# Altium schematic sheet ESP32.SchDoc
size A4
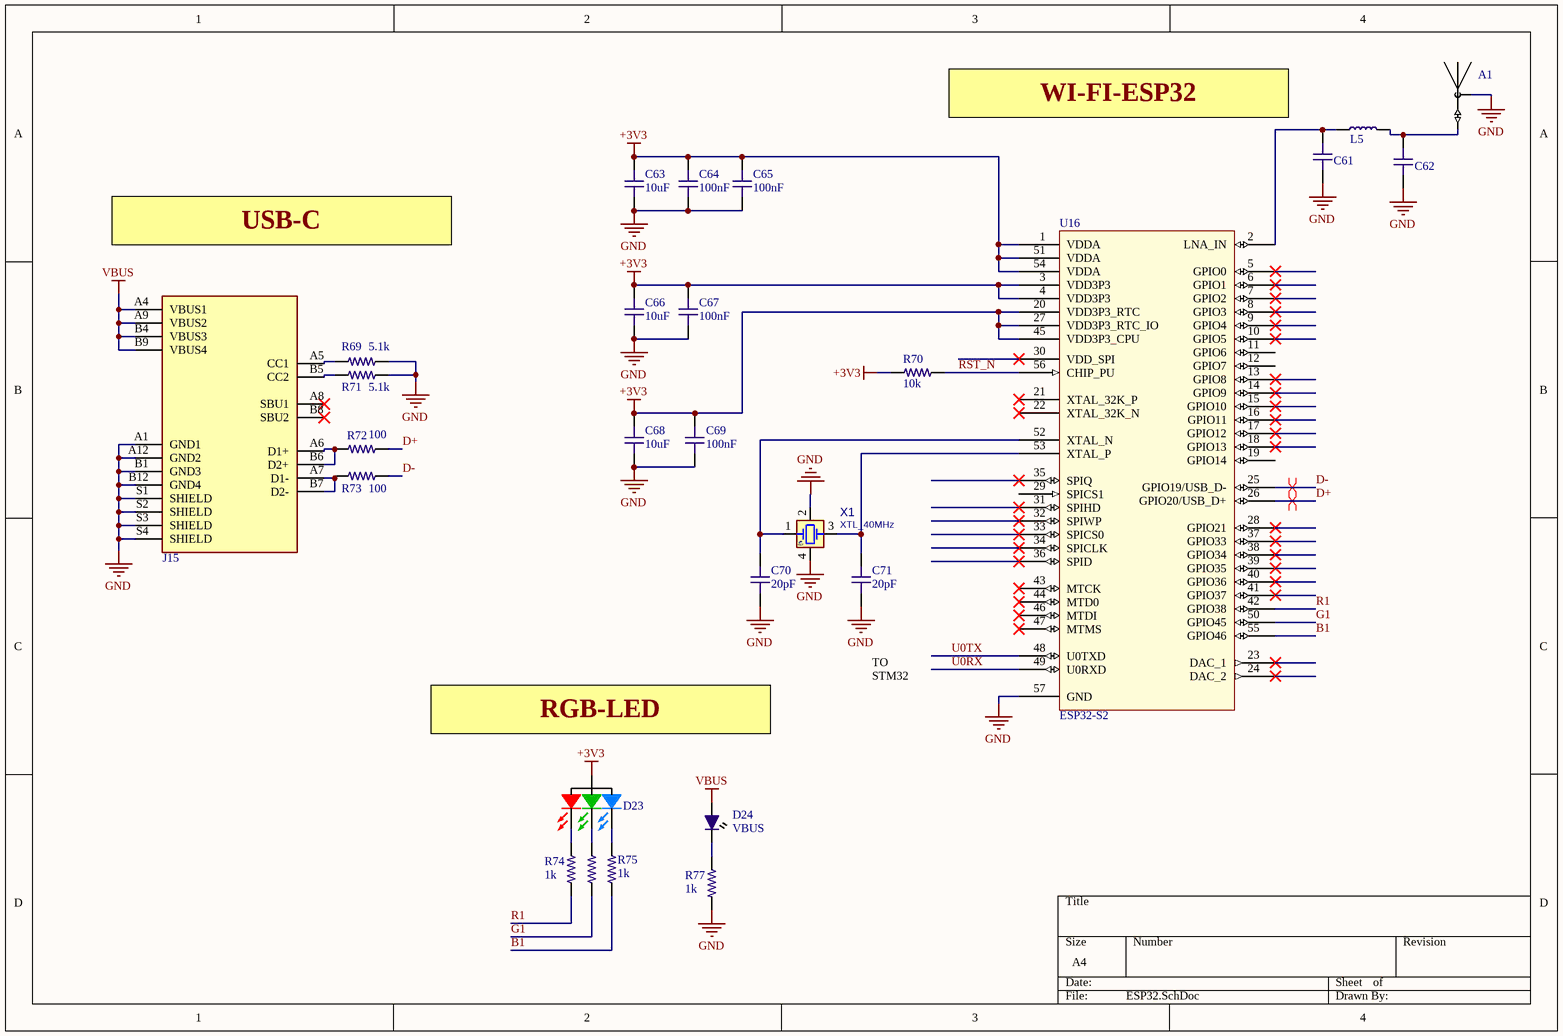
[diagram p0: ESP32.SchDoc]

## Parts
A1  0479480001  [0479480001]  (value not drawn)
C61  0402 Capacitor Template  [C0402-HIGH-DENSITY]  (value not drawn)
C62  0402 Capacitor Template  [C0402-HIGH-DENSITY]  (value not drawn)
C63  value 10uF  [C0402-HIGH-DENSITY]  (hidden comment: C0402 10uF 10V)
C64  value 100nF  [C0402-HIGH-DENSITY]  (hidden comment: C0402 100nF 10V X5R)
C65  value 100nF  [C0402-HIGH-DENSITY]  (hidden comment: C0402 100nF 10V X5R)
C66  value 10uF  [C0402-HIGH-DENSITY]  (hidden comment: C0402 10uF 10V)
C67  value 100nF  [C0402-HIGH-DENSITY]  (hidden comment: C0402 100nF 10V X5R)
C68  value 10uF  [C0402-HIGH-DENSITY]  (hidden comment: C0402 10uF 10V)
C69  value 100nF  [C0402-HIGH-DENSITY]  (hidden comment: C0402 100nF 10V X5R)
C70  value 20pF  [C0402-HIGH-DENSITY]  (hidden comment: C0402 100nF 10V X5R)
C71  value 20pF  [C0402-HIGH-DENSITY]  (hidden comment: C0402 100nF 10V X5R)
D23  RGB  [RGB-LED]  (value not drawn)
D24  VBUS  [LED0603-IPC]
J15  16 Pin Mid Mount USB C  [USB-C - 16 Pin Mid Mount]  (value not drawn)
L5  ! Inductor Template  [L0402-Murata-WW-High-Density]  (value not drawn)
R69  value 5.1k  [R0402-HIGH-DENSITY]  (hidden comment: R0402 5.1K 1%)
R70  value 10k  [R0402-HIGH-DENSITY]  (hidden comment: R0402 10k 1%)
R71  value 5.1k  [R0402-HIGH-DENSITY]  (hidden comment: R0402 5.1K 1%)
R72  value 100  [R0402-HIGH-DENSITY]  (hidden comment: R0402 100R 1%)
R73  value 100  [R0402-HIGH-DENSITY]  (hidden comment: R0402 100R 1%)
R74  value 1k  [R0402-HIGH-DENSITY]  (hidden comment: R0402 1k 1%)
R75  value 1k  [R0402-HIGH-DENSITY]  (hidden comment: R0402 1k 1%)
R76  R0402 1k 1%  [R0402-HIGH-DENSITY]  (value not drawn)
R77  value 1k  [R0402-HIGH-DENSITY]  (hidden comment: R0402 1k 1%)
U16  ESP32-S2  [QFN56]
X1  XTL_40MHz  [XTL_4_2016]

## Nets
+3V3: C63.2 C64.2 C65.2 C66.2 C67.2 C68.2 C69.2 D23.A R70.1 U16.1(VDDA) U16.3(VDD3P3) U16.4(VDD3P3) U16.20(VDD3P3_RTC) U16.27(VDD3P3_RTC_IO) U16.45(VDD3P3_CPU) U16.51(VDDA) U16.54(VDDA)
GND: A1.2 C61.1 C62.1 C63.1 C64.1 C65.1 C66.1 C67.1 C68.1 C69.1 C70.1 C71.1 J15.A1(GND1) J15.A12(GND2) J15.B1(GND3) J15.B12(GND4) J15.S1(SHIELD) J15.S2(SHIELD) J15.S3(SHIELD) J15.S4(SHIELD) R69.2 R71.2 R77.1 U16.57(GND) X1.2(GND1) X1.4(GND2)
VBUS: D24.A J15.A4(VBUS1) J15.A9(VBUS2) J15.B4(VBUS3) J15.B9(VBUS4)
B1: R75.1 U16.55(GPIO46)
D+: R72.2 U16.26(GPIO20/USB_D+)
D-: R73.2 U16.25(GPIO19/USB_D-)
G1: R76.1 U16.50(GPIO45)
R1: R74.1 U16.42(GPIO38)
RST_N: R70.2 U16.56(CHIP_PU)
U0RX: U16.49(U0RXD)
U0TX: U16.48(U0TXD)
NetA1_1: A1.1(FEED) C62.2 L5.2
NetC61_2: C61.2 L5.1 U16.2(LNA_IN)
NetC70_2: C70.2 U16.52(XTAL_N) X1.1(XA)
NetC71_2: C71.2 U16.53(XTAL_P) X1.3(XB)
NetD23_BK: D23.BK R75.2
NetD23_GK: D23.GK R76.2
NetD23_RK: D23.RK R74.2
NetD24_K: D24.K R77.2
NetJ15_A5: J15.A5(CC1) R69.1
NetJ15_A6: J15.A6(D1+) J15.B6(D2+) R72.1
NetJ15_A7: J15.A7(D1-) J15.B7(D2-) R73.1
NetJ15_B5: J15.B5(CC2) R71.1

Not connected (* = marked no-connect by the designer): J15 A8(SBU1)* B8(SBU2)*; U16 5(GPIO0)* 6(GPIO1)* 7(GPIO2)* 8(GPIO3)* 9(GPIO4)* 10(GPIO5)* 11(GPIO6) 12(GPIO7) 13(GPIO8)* 14(GPIO9)* 15(GPIO10)* 16(GPIO11)* 17(GPIO12)* 18(GPIO13)* 19(GPIO14) 21(XTAL_32K_P)* 22(XTAL_32K_N)* 23(DAC_1)* 24(DAC_2)* 28(GPIO21)* 29(SPICS1) 30(VDD_SPI)* 31(SPIHD)* 32(SPIWP)* 33(SPICS0)* 34(SPICLK)* 35(SPIQ)* 36(SPID)* 37(GPIO33)* 38(GPIO34)* 39(GPIO35)* 40(GPIO36)* 41(GPIO37)* 43(MTCK)* 44(MTD0)* 46(MTDI)* 47(MTMS)*

## Layout directives
differential pair: D+, D-

## Notes on the sheet
- WI-FI-ESP32
- USB-C
- TO STM32
- RGB-LED

## Library data of the parts
A1 = Molex 0479480001: 2.4GHz Bluetooth, WLAN, Zigbee™ Chip RF Antenna 2.4GHz ~ 2.483.5GHz 3dBi Solder Surface Mount; Supplier 1: Digi-Key; Supplier 2: Mouser; Supplier Part Number 2: 538-47948-0001; Supplier Part Number 1: WM4893CT-ND
C61 C62 = 0402 Capacitor Template: Chip Capacitor, 0402, ??nF, 10V, X7R; EIA Code: X7R; Max. Voltage: 10V; Value: ??nF
C63 C66 C68 = C0402 10uF 10V: Chip Capacitor, 0402, 10uF, 10V, X5R; EIA Code: X5R; Max. Voltage: 10V; Supplier 1: Digi-Key; Supplier Part Number 1: 1276-1450-2-ND
C64 C65 C67 C69-C71 = C0402 100nF 10V X5R: Chip Capacitor, 0402, 100nF, 10V, X5R; EIA Code: X5R; Max. Voltage: 10V; Supplier 1: Digi-Key; Supplier Part Number 1: 311-1336-1-ND
D23 = Led_RGB_0606: RGB Led 1.6 x 1.6 mm Diffused; Manufacturer: Everlight; Manufacturer Part Number: 19-237/R6GHBHW-C01/2T; Supplier 1: Digi-Key; Supplier Part Number 1: 1080-1590-1-ND
D24 = LED 0603 Yellow: LED YELLOW CLEAR 0603 SMD; Supplier 1: Digi-Key; Supplier Part Number 1: 732-4981-1-ND
J15 = USB C USB 2.0 and PD: USB-C USB 2.0 5A PD 16 Position Mid Mount; Manufacturer: Jing Extension of the Electronic Co; Supplier 1: LCSC; Supplier Part Number 1: C168688
L5 = ! Inductor Template: Inductor, ??uH; Value: ??H
R69 R71 = R0402 5.1K 1%: RES SMD 5.1K OHM 1% 1/10W 0402; Temperature Coefficient: ±100ppm/°C; Features: Automotive AEC-Q200; Operating Temperature: -55°C ~ 155°C
R70 = R0402 10k 1%: Chip Resistor, 0402, 10k ohms, 1%, 1/16 W; Supplier 1: Digi-Key; Supplier Part Number 1: 311-10.0KLRCT-ND
R72 R73 = R0402 100R 1%: Chip Resistor, 0402, 100 ohms, 1%, 1/16 W; Supplier 1: Digi-Key; Supplier Part Number 1: 311-100LRCT-ND
R74-R77 = R0402 1k 1%: Chip Resistor, 0402, 1k ohms, 1%, 1/16 W; Supplier 1: Digi-Key; Supplier Part Number 1: 311-1.00KLRCT-ND
  R76: Value: 1k
U16 = ESP32-S2: WiFi 802.11b/g/n Transceiver Module 2.4GHz QFN-56; Supplier 1: Digi-Key; Supplier 2: Mouser; Supplier Part Number 1: 1965-ESP32-S2CT-ND; Supplier Part Number 2: 356-ESP32-S2; Supplier 3: LCSC; Supplier Part Number 3: C529594
X1 = XTL_4_40MHz_2016F: CRYSTAL 40.00 MHZ 7pF, 10PPM; MANF: DIODES; PARAM: 10PPM, -30~85oC; DESC: X1E000021036701; DIST#: MOUSER; PARAM2: 7pF, 40OhmESR; MANF_P#: FW400WFQA1; ASSEMBLY: ASSEMBLY; PRICE: 1$; VALUE: XTL_40MHz